# EAGLE design BacklightCastel (EAGLE 9.2.2)
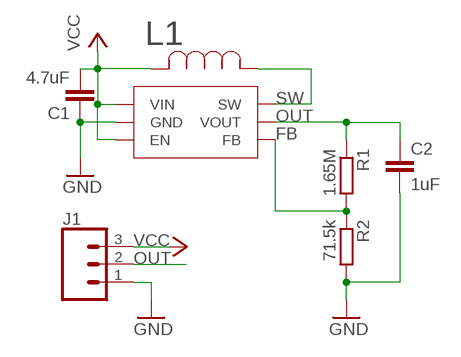
[diagram p0: schematic, sheet 1]

## Parts
C1  4.7uF  C-EUC0603  [C0603]
C2  1uF  C-EUC0603  [C0603]
J1  CONN_03  [1X03]
L1  22uH  NRS5020T220MMGJ  [IND_TAIYO_NRS5020]
R1  1.65M  R-EU_R0603  [R0603]
R2  71.5k  R-EU_R0603  [R0603]
U1  TLV61046A  [SOT-23-6]

## Nets
FB: R1.2 R2.1 U1.3(FB)
GND: C1.1 C2.2 J1.1 R2.2 U1.2(GND)
OUT: C2.1 J1.2 R1.1 U1.5(VOUT)
SW: L1.1 U1.1(SW)
VCC: C1.2 J1.3 L1.2 U1.4(EN) U1.6(VIN)

## Library data of the parts
C1 C2 = rcl:C-EU: CAPACITOR, European symbol; SPICEPREFIX: C
J1 = SparkFun-Connectors:CONN_03: Multi connection point. Often used as Generic Header-pin footprint for 0.1 inch spaced/style header connections On any of the 0.1 inch spaced packages, you can populate with these: Break Away Headers - Straight <https://www.sparkfun.com/products/116> (PRT-00116) Break Away Male Headers - Right Angle <https://www.sparkfun.com/products/553> (PRT-00553) Female Headers <https://www.sparkfun.com/products/115> (PRT-00115) Break Away Headers - Machine Pin <https://www.sparkfun.com/products/117> (PRT-00117) Break Away Female Headers - Swiss Machine Pin <https://www.sparkfun.com/products/743> (PRT-00743) Stackable Header - 3 Pin (Female, 0.1") <https://www.sparkfun.com/products/13875> (PRT-13875) For SCREWTERMINALS and SPRING TERMINALS visit here: Screw Terimnals on SparkFun.com <https://www.sparkfun.com/search/results?term=Screw+Terminals> (5mm/3.5mm/2.54mm spacing) This device is also useful as a general connection point to wire up your design to another part of your project. Our various solder wires solder well into these plated through hole pads. Hook-Up Wire - Assortment (Stranded, 22 AWG) <https://www.sparkfun.com/products/11375> (PRT-11375) Hook-Up Wire - Assortment (Solid Core, 22 AWG) <https://www.sparkfun.com/products/11367> (PRT-11367) View the entire wire category on our website here <https://www.sparkfun.com/categories/141> Special notes: Molex polarized connector foot print use with SKU : PRT-08232 with associated crimp pins and housings.
L1 = dsl:NRS5020T220MMGJ; MANUFACTURER_PART_NUMBER: NRS5020T220MMGJ; VENDOR: TAIYO YUDEN
R1 R2 = resistor:R-EU_: RESISTOR, European symbol
U1 = dsl:TLV61046A

## Board
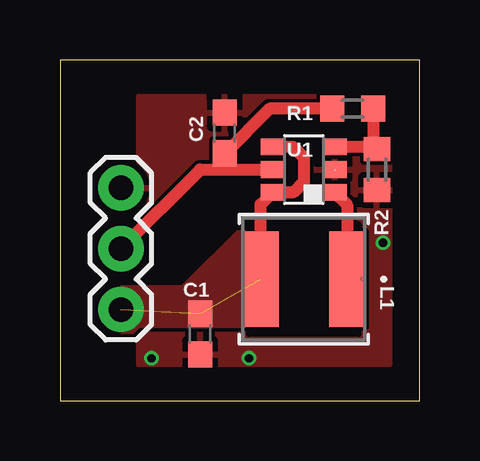
[diagram p1: board, top side]
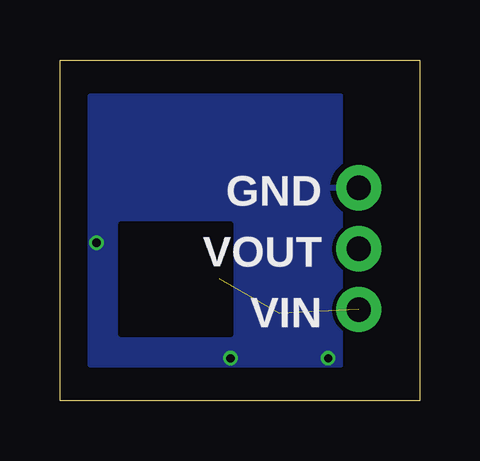
[diagram p2: board, bottom side, seen from below]

Size 14.99 x 14.22 mm. Coordinates in mm from the lower left corner, seen from the top.
Outline: 0,0 14.99,0 14.99,14.22 0,14.22 0,0
Copper layers (1*16): Top 0.035559375mm / dielectric 1.6mm / Bottom 0.035559375mm
Design rules "OshPark": minimum track width 6mil, minimum drill 10mil, track to track 6mil, track to pad 6mil, pad to pad 6mil, via to via 6mil, smd to smd 6mil, copper to edge 15mil, drill to drill 6mil, minimum pad ring 5mil, minimum via ring 5mil, stop-mask expansion 2.5mil, vias tented up to drill 0mil, thermal gap 10mil
tRestrict: area 7.9,2.8 to 12.4,7.4
bRestrict: area 7.9,2.8 to 12.4,7.4

### Footprints (pad centres in the part's own frame; a part is rotated, then mirrored left to right if it is on the bottom)
C0603 = smd 1.1 x 1: 1 -0.85,0; 2 0.85,0
1X03 = drill 1.016 pad 1.88: 1 0,0; 2 2.54,0; 3 5.08,0
IND_TAIYO_NRS5020 = smd 1.499 x 3.988: 1 -1.803,0; 2 1.803,0
R0603 = smd 1 x 1.1: 1 -0.85,0; 2 0.85,0
SOT-23-6 = smd 0.69 x 0.99: 1 -0.95,-1.29; 2 0,-1.29; 3 0.95,-1.29; 4 0.95,1.3; 5 0,1.3; 6 -0.95,1.3

### Placement (x,y rotation side)
C1  5.84,2.79 90 top
C2  6.86,11.18 90 top
J1  2.54,8.89 270 top
L1  10.16,5.08 180 top
R1  12.19,12.19 0 top
R2  13.21,9.65 270 top
U1  10.16,9.65 90 top

### Tracks (layer width: path | path; a pad name or v marks a point on that pad's centre or on a via)
FB
  Top 0.508: U1.3 13.11,10.6 R2.1 13.04,10.67 R1.2
GND  (via drill 0.35)
  other vias: 13.46,6.6 3.81,1.78 7.87,1.78
  pour Top (rank 2): 3.3,12.7 13.72,12.7 13.72,1.52 3.3,1.52
  pour Bottom: 3.3,12.7 13.72,12.7 13.72,1.52 3.3,1.52
OUT
  Top 0.508: J1.2 5.84,9.65 6.86,9.65 | 6.86,9.65 U1.5 | 6.86,9.65 C2.1 8.72,12.19 R1.1
SW
  Top 0.508: U1.1 11.96,8.19 L1.1
VCC  (2 unrouted)
  Top 0.508: L1.2 8.36,8.2 U1.6 9.72,8.7 10.16,9.14 10.16,10.16 9.72,10.6 U1.4
  pour Top (no thermals): 2.54,4.83 5.08,4.83 7.37,7.11 9.14,7.11 9.14,3.05 3.3,3.05 3.05,2.79 2.54,2.79

### Text on the board
bPlace: GND | VOUT | VIN